# Altium project diy-drone.PrjPCB
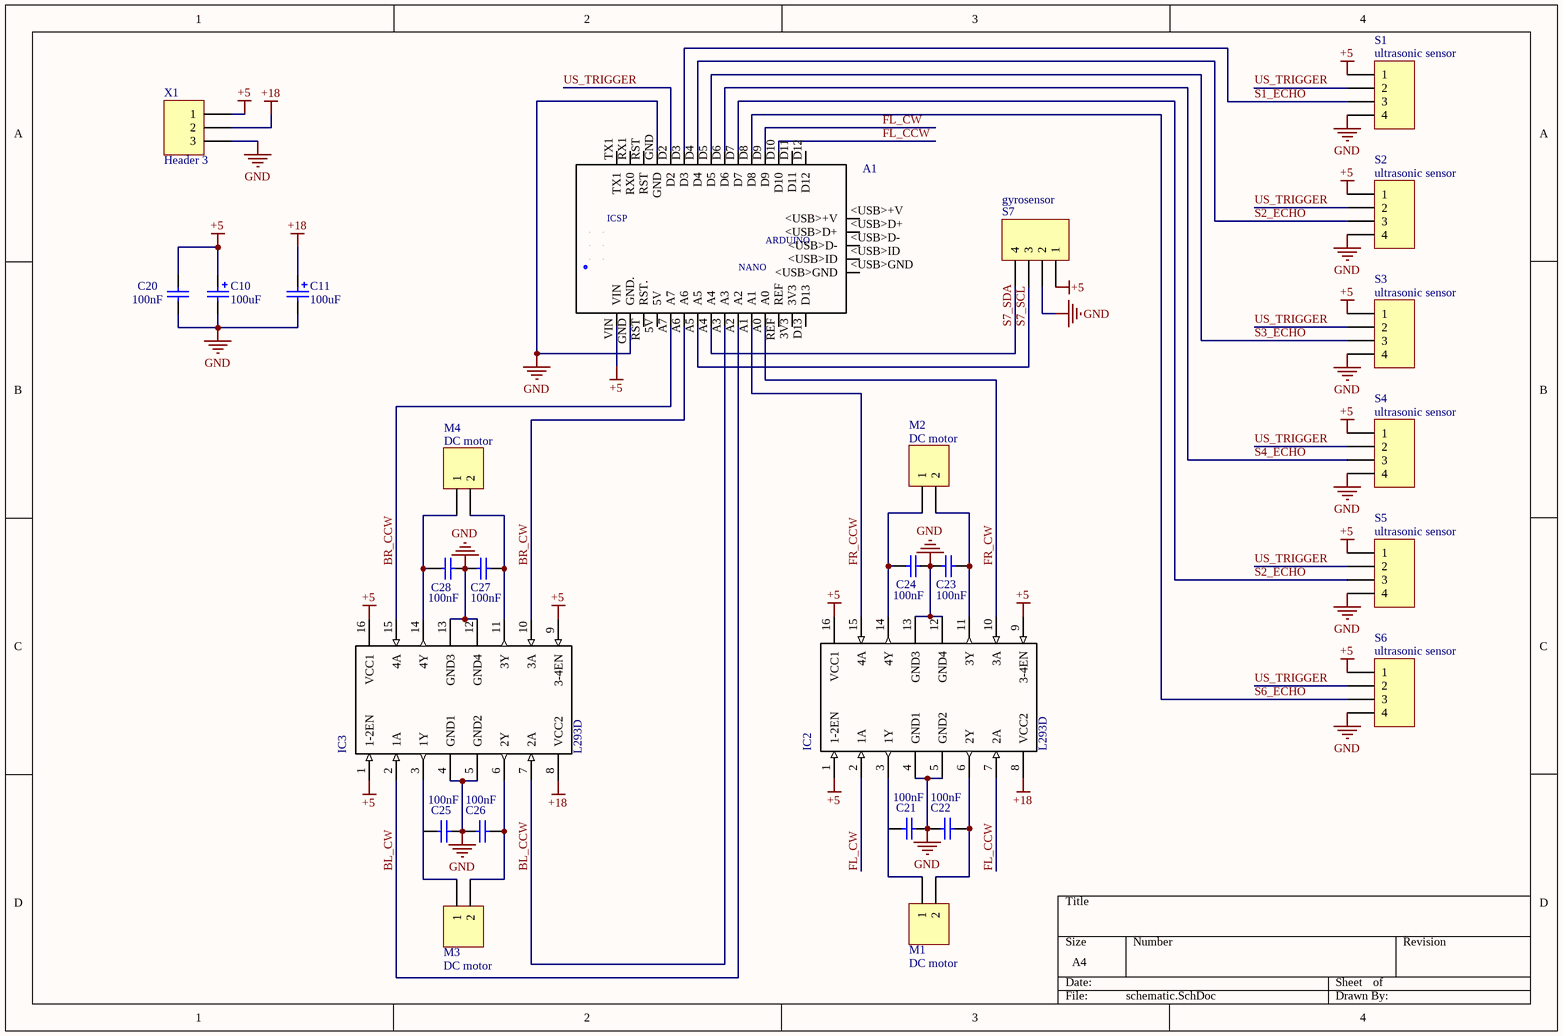
[diagram p0: schematic.SchDoc]
1 sheet, 26 parts. Net scope: global (net labels, ports and power ports of the same name join across sheets).
Board file: PCB.PcbDoc

## Sheet schematic.SchDoc: DIY-DRONE
size A4; Date: 2018-02-01; Author: Cloud Garage; CompanyName: Cloud Garage; DrawnBy: Cloud Garage; Engineer: Cloud Garage; Organization: Cloud Garage; DocumentNumber: 1; Revision: 1.0; SheetNumber: 1; SheetTotal: 1; CurrentDate: 2018-02-01; DocumentName: DIY-DRONE; ModifiedDate: 2018-02-01; ProjectName: DIY-DRONE

### Parts
A1  ARDUINO_NANO  [ARDUINO_NANO_ARDUINO_NANO(Primary)]  (value not drawn)
C10  value 100uF  [POLAR0.8]  (hidden comment: Cap Pol2)
C11  value 100uF  [POLAR0.8]  (hidden comment: Cap Pol2)
C20  value 100nF  [RAD-0.3]  (hidden comment: Cap)
C21  value 100nF  [RAD-0.3]  (hidden comment: Cap)
C22  value 100nF  [RAD-0.3]  (hidden comment: Cap)
C23  value 100nF  [RAD-0.3]  (hidden comment: Cap)
C24  value 100nF  [RAD-0.3]  (hidden comment: Cap)
C25  value 100nF  [RAD-0.3]  (hidden comment: Cap)
C26  value 100nF  [RAD-0.3]  (hidden comment: Cap)
C27  value 100nF  [RAD-0.3]  (hidden comment: Cap)
C28  value 100nF  [RAD-0.3]  (hidden comment: Cap)
IC2  L293D  [DIL16]
IC3  L293D  [DIL16]
M1  DC motor  [HDR1X2]
M2  DC motor  [HDR1X2]
M3  DC motor  [HDR1X2]
M4  DC motor  [HDR1X2]
S1  ultrasonic sensor  [HDR1X4]
S2  ultrasonic sensor  [HDR1X4]
S3  ultrasonic sensor  [HDR1X4]
S4  ultrasonic sensor  [HDR1X4]
S5  ultrasonic sensor  [HDR1X4]
S6  ultrasonic sensor  [HDR1X4]
S7  gyrosensor  [HDR1X4]
X1  Header 3  [HDR1X3]

### Nets
+5: A1.VIN C10.1 C20.1 IC2.1(1-2EN) IC2.9(3-4EN) IC2.16(VCC1) IC3.1(1-2EN) IC3.9(3-4EN) IC3.16(VCC1) S1.1 S2.1 S3.1 S4.1 S5.1 S6.1 S7.1 X1.1
+18: C11.1 IC2.8(VCC2) IC3.8(VCC2) X1.2
GND: A1.GND(GND.) C10.2 C11.2 C20.2 C21.2 C22.1 C23.2 C24.1 C25.2 C26.1 C27.2 C28.1 IC2.4(GND1) IC2.5(GND2) IC2.12(GND4) IC2.13(GND3) IC3.4(GND1) IC3.5(GND2) IC3.12(GND4) IC3.13(GND3) S1.4 S2.4 S3.4 S4.4 S5.4 S6.4 S7.2 X1.3
BL_CCW: A1.A3 IC3.7(2A)
BL_CW: A1.A2 IC3.2(1A)
BR_CCW: A1.A7 IC3.15(4A)
BR_CW: A1.A6 IC3.10(3A)
FL_CCW: A1.D10 IC2.7(2A)
FL_CW: A1.D9 IC2.2(1A)
FR_CCW: A1.A1 IC2.15(4A)
FR_CW: A1.A0 IC2.10(3A)
S1_ECHO: A1.D3 S1.3
S2_ECHO: A1.D4 A1.D7 S2.3 S5.3
S3_ECHO: A1.D5 S3.3
S4_ECHO: A1.D6 S4.3
S6_ECHO: A1.D8 S6.3
S7_SCL: A1.A5 S7.3
S7_SDA: A1.A4 S7.4
US_TRIGGER: A1.D2 S1.2 S2.2 S3.2 S4.2 S5.2 S6.2
NetC22_2: C22.2 IC2.6(2Y) M1.2
NetC23_1: C23.1 IC2.11(3Y) M2.2
NetC24_2: C24.2 IC2.14(4Y) M2.1
NetC26_2: C26.2 IC3.6(2Y) M3.2
NetC27_1: C27.1 IC3.11(3Y) M4.2
NetC28_2: C28.2 IC3.14(4Y) M4.1
NetIC2_3: IC2.3(1Y) M1.1
NetIC3_3: IC3.3(1Y) M3.1

Not connected (* = marked no-connect by the designer): A1 3V3 5V <USB>+V <USB>D+ <USB>D- <USB>GND <USB>ID D11 D12 D13 GND_ MISO MOSI REF RESET(RESET..) RST(RST.) RX1(RX0) SCK TX1; C21 1; C25 1

### Notes on the sheet
- (in symbol ARDUINO_NANO) ICSP; ARDUINO; NANO

### Library data of the parts
A1 = ARDUINO_NANO: Dev.kit: Arduino; UART; ICSP, USB B mini, pin strips; MP: ARDUINO NANO; Package: None; Price: 22.14 USD; MF: Arduino; Availability: Unavailable; Value: *
C10 C11 = Cap Pol2: Polarized Capacitor (Axial); Published: 8-Jun-2000; LatestRevisionDate: 17-Jul-2002; LatestRevisionNote: Re-released for DXP Platform.; PackageReference: POLAR0.8; Publisher: Altium Limited; PackageDescription: Polarized Capacitor; 2 Leads
C20-C28 = Cap: Capacitor; Published: 8-Jun-2000; LatestRevisionDate: 17-Jul-2002; LatestRevisionNote: Re-released for DXP Platform.; PackageReference: RAD-0.3; Publisher: Altium Limited; PackageDescription: Radial Cap, Thru-Hole; 2 Leads; 0.3 in Pin Spacing
IC2 IC3 = L293D: IC MOTOR DRIVER PAR 16-DIP; MF: STMicroelectronics; MP: L293D; Package: SOIC-20 STMicroelectronics; Availability: Good; Price: 2.54 USD; Value: *
M1-M4 = Header 2: Header, 2-Pin; LatestRevisionDate: 17-Jul-2002; LatestRevisionNote: Re-released for DXP Platform.; Publisher: Altium Limited
S1-S7 = Header 4: Header, 4-Pin; LatestRevisionDate: 17-Jul-2002; LatestRevisionNote: Re-released for DXP Platform.; Publisher: Altium Limited
X1 = Header 3: Header, 3-Pin; LatestRevisionDate: 17-Jul-2002; LatestRevisionNote: Re-released for DXP Platform.; Publisher: Altium Limited